# Altium schematic sheet USB-serial converter.SchDoc
size A4
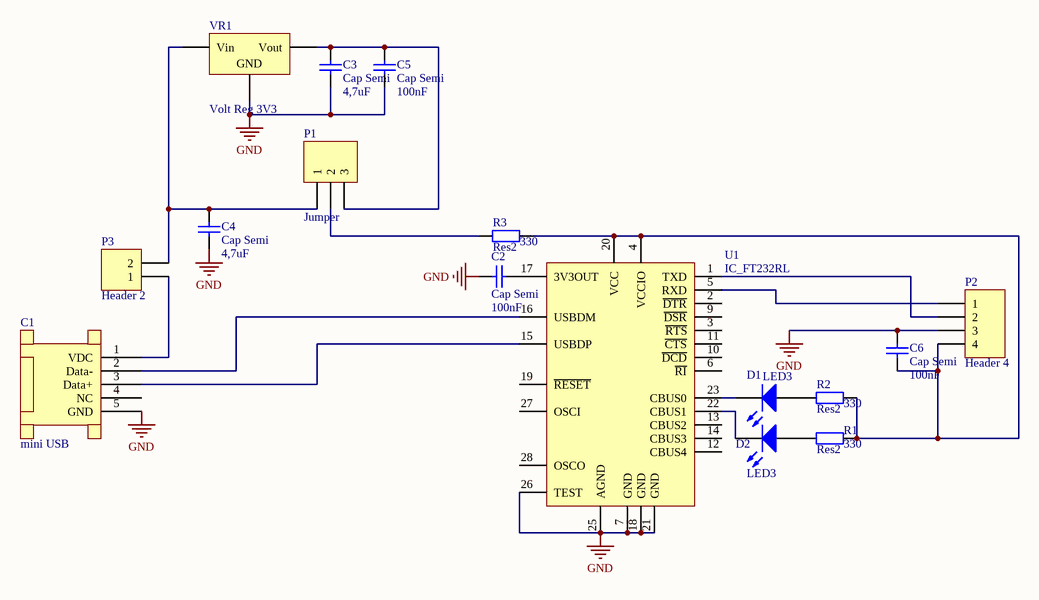
[diagram p0: USB-serial converter.SchDoc]

## Parts
C1  mini USB  [USB/SM0.8-6H5]
C2  Cap Semi  value 100nF  [RESC2012N]
C3  Cap Semi  value 4,7uF  [RESC2012N]
C4  Cap Semi  value 4,7uF  [RESC2012N]
C5  Cap Semi  value 100nF  [RESC2012N]
C6  Cap Semi  value 100nF  [RESC2012N]
D1  LED3  [RESC2012N]
D2  LED3  [RESC2012N]
P1  Jumper  [HDR1X3]
P2  Header 4  [HDR1X4]
P3  Header 2  [HDR1X2]
R1  Res2  value 330  [RESC2012N]
R2  Res2  value 330  [RESC2012N]
R3  Res2  value 330  [RESC1608L]
U1  IC_FT232RL  [SSOP-28]
VR1  Volt Reg 3V3  [SOT223-4N]

## Nets
GND: C1.5(GND) C2.1 C3.1 C4.1 C5.1 C6.2 P2.3 U1.7(GND) U1.18(GND) U1.21(GND) U1.25(AGND) U1.26(TEST) VR1.2(GND)
NC: U1.8(NC) U1.24(NC)
NetC1_1: C1.1(VDC) P3.1
NetC1_2: C1.2(Data-) U1.16(USBDM)
NetC1_3: C1.3(Data+) U1.15(USBDP)
NetC2_2: C2.2 U1.17(3V3OUT)
NetC3_2: C3.2 C5.2 P1.3 VR1.3(Vout)
NetC4_2: C4.2 P1.1 P3.2 VR1.1(Vin)
NetC6_1: C6.1 P2.4 R1.1 R2.1 R3.1 U1.4(VCCIO) U1.20(VCC)
NetD1_1: D1.1(A) R2.2
NetD1_2: D1.2(K) U1.23(CBUS0)
NetD2_1: D2.1(A) R1.2
NetD2_2: D2.2(K) U1.22(CBUS1)
NetP1_2: P1.2 R3.2
NetP2_1: P2.1 U1.5(RXD)
NetP2_2: P2.2 U1.1(TXD)

Not connected (* = marked no-connect by the designer): C1 4(NC); U1 2(~{DTR}) 3(~{RTS}) 6(~{RI}) 9(~{DSR}) 10(~{DCD}) 11(~{CTS}) 12(CBUS4) 13(CBUS2) 14(CBUS3) 19(~{RESET}) 27(OSCI) 28(OSCO)

## Library data of the parts
C2-C6 = Cap Semi: Capacitor (Semiconductor SIM Model); Published: 8-Jun-2000; LatestRevisionDate: 29-May-2009; LatestRevisionNote: IPC-7351 Footprint Added.; PackageReference: C1206; Publisher: Altium Limited; PackageDescription: Chip Capacitor
D1 D2 = LED3: Typical BLUE SiC LED; Published: 8-Jun-2000; LatestRevisionDate: 17-Dec-2003; LatestRevisionNote: PCB Footprint replaced.; DatasheetVersion: 16-Apr-2002; PackageVersion: 16-Apr-2002; PackageReference: 3.5X2.8X1.9; Publisher: Altium Limited
P1 = Header 3: Header, 3-Pin; LatestRevisionDate: 17-Jul-2002; LatestRevisionNote: Re-released for DXP Platform.; Publisher: Altium Limited
P2 = Header 4: Header, 4-Pin; LatestRevisionDate: 17-Jul-2002; LatestRevisionNote: Re-released for DXP Platform.; Publisher: Altium Limited
P3 = Header 2: Header, 2-Pin; LatestRevisionDate: 17-Jul-2002; LatestRevisionNote: Re-released for DXP Platform.; Publisher: Altium Limited
R1-R3 = Res2: Resistor; Published: 8-Jun-2000; LatestRevisionDate: 17-Jul-2002; LatestRevisionNote: Re-released for DXP Platform.; PackageReference: AXIAL-0.4; Publisher: Altium Limited
U1 = IC_FT232RL: FT232R USB UART; Manufacturer: *; Note: *; ManufacturerPartNo: *
VR1 = Volt Reg: Voltage Regulator; pin to pad: 1>3 2>1 3>2; Published: 24-Mar-1999; LatestRevisionDate: 29-May-2009; LatestRevisionNote: IPC-7351 Footprint Added.; PackageReference: D2PAK; Publisher: Altium Limited; PackageDescription: 3-Pin Transistor Outline Package 2.54 mm Pitch, 15.1 mm Lead Span